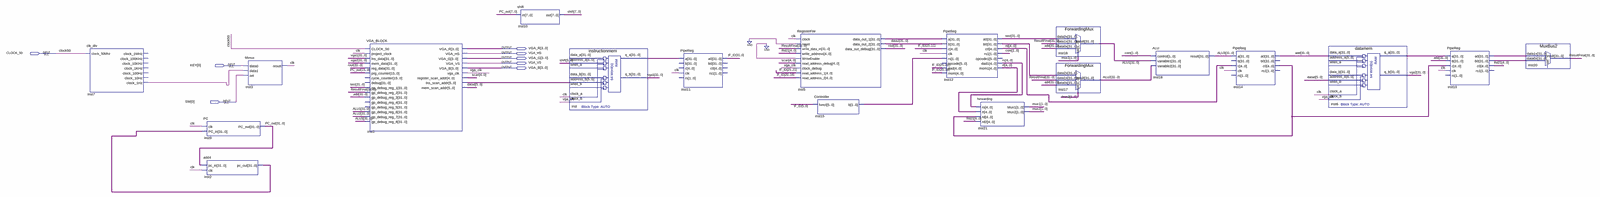
[diagram p0: schematic sheet, whole]
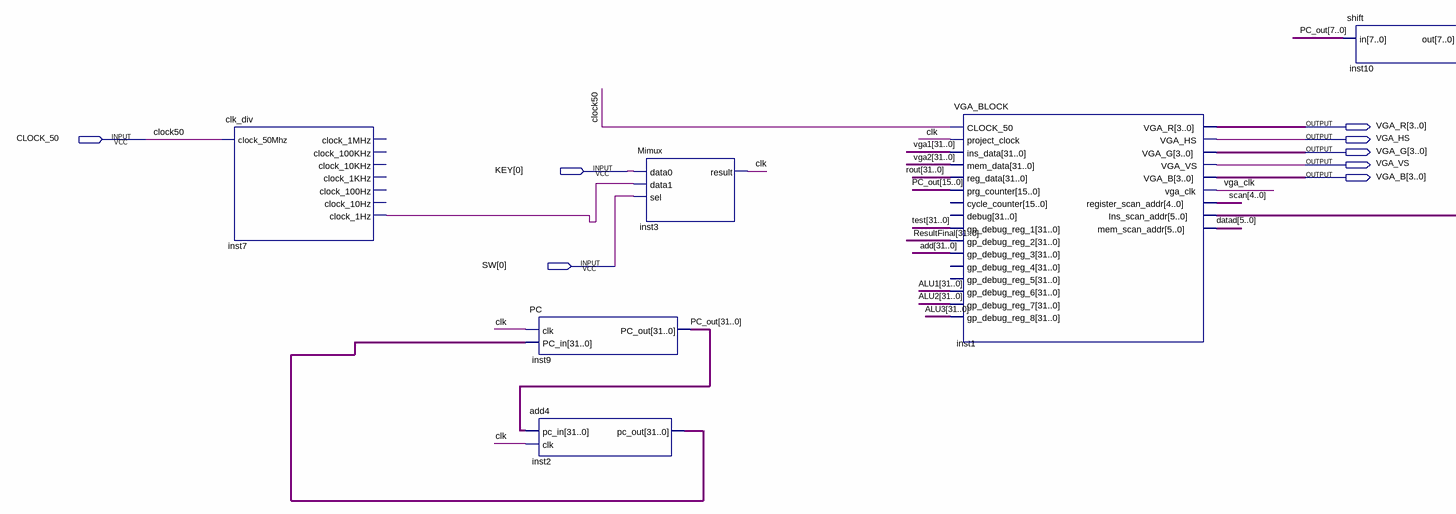
[diagram p1: schematic sheet, left part]
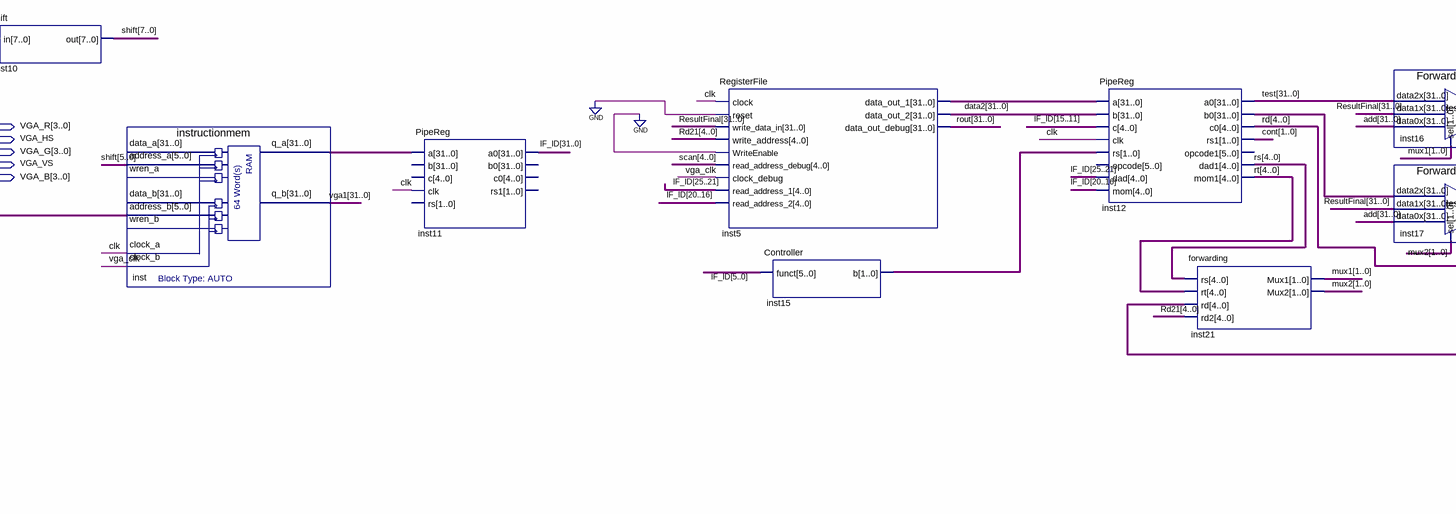
[diagram p2: schematic sheet, centre part]
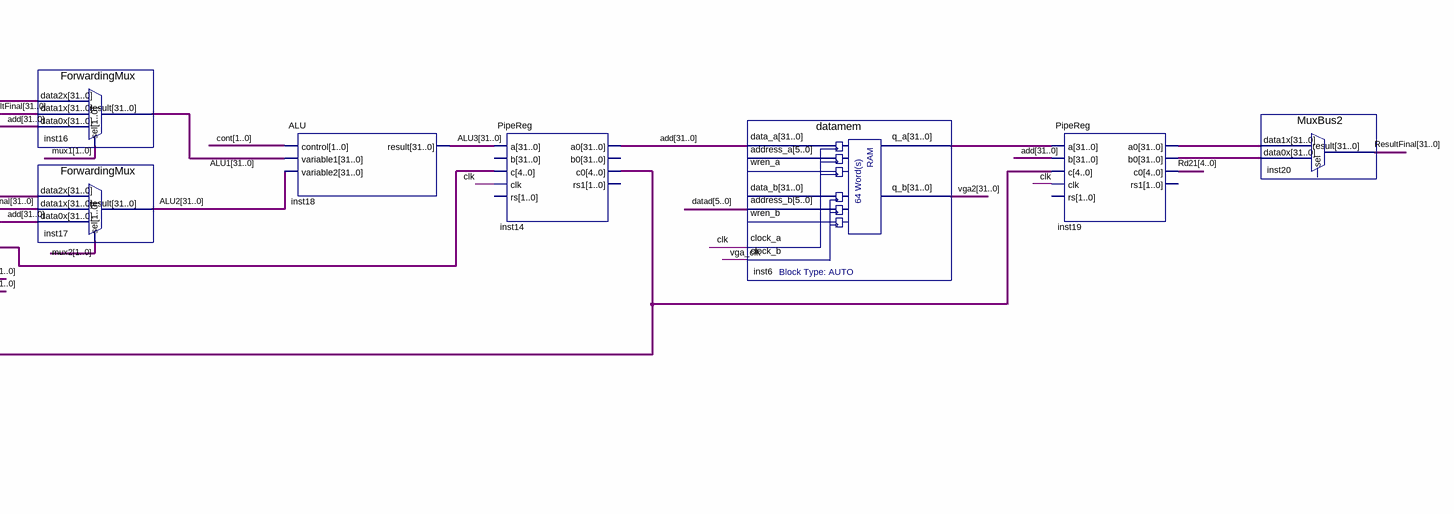
[diagram p3: schematic sheet, right part]
// Quartus schematic Lab5.bdf as structural Verilog: 19 symbols, 8 pins
module Lab5 (
  input  CLOCK_50,
  input  [0:0] KEY,
  input  [0:0] SW,
  output [3:0] VGA_R,
  output VGA_HS,
  output [3:0] VGA_G,
  output VGA_VS,
  output [3:0] VGA_B
);

  wire clk, inst7_clock_1hz, vga_clk;
  wire [1:0] cont, inst15_b, mux1, mux2;
  wire [4:0] inst14_c0, rd, Rd21, rs, rt, scan;
  wire [5:0] datad, inst1_ins_scan_addr;
  wire [7:0] shift;
  wire [31:0] add, ALU1, ALU2, ALU3, data2, IF_ID, inst2_pc_out, inst5_data_out_1, inst6_q_a, inst12_b0,
       inst19_a0, inst19_b0, inst_q_a, PC_out, ResultFinal, rout, test, vga1, vga2;

  clk_div inst7 (
    .clock_50Mhz(CLOCK_50), .clock_1Hz(inst7_clock_1hz));  // open: clock_1MHz, clock_100KHz, clock_10KHz, clock_1KHz, clock_100Hz, clock_10Hz
  PC inst9 (.clk(clk), .PC_in(inst2_pc_out), .PC_out(PC_out));
  add4 inst2 (.pc_in(PC_out), .clk(clk), .pc_out(inst2_pc_out));
  Mimux inst3 (.data0(KEY[0]), .data1(inst7_clock_1hz), .sel(SW[0]), .result(clk));
  VGA_BLOCK inst1 (
    .CLOCK_50(CLOCK_50), .project_clock(clk), .ins_data(vga1), .mem_data(vga2), .reg_data(rout),
    .prg_counter(PC_out[15:0]), .gp_debug_reg_1(test), .gp_debug_reg_2(ResultFinal), .gp_debug_reg_3(add),
    .gp_debug_reg_6(ALU1), .gp_debug_reg_7(ALU2), .gp_debug_reg_8(ALU3), .VGA_R(VGA_R), .VGA_HS(VGA_HS),
    .VGA_G(VGA_G), .VGA_VS(VGA_VS), .VGA_B(VGA_B), .vga_clk(vga_clk), .register_scan_addr(scan),
    .Ins_scan_addr(inst1_ins_scan_addr), .mem_scan_addr(datad));  // open: cycle_counter, debug, gp_debug_reg_4, gp_debug_reg_5
  shift inst10 (.in(PC_out[7:0]), .out(shift));
  instructionmem inst (
    .address_a(shift[5:0]), .address_b(inst1_ins_scan_addr), .clock_a(clk), .clock_b(vga_clk),
    .q_a(inst_q_a), .q_b(vga1));  // open: data_a, wren_a, data_b, wren_b
  PipeReg inst11 (.a(inst_q_a), .clk(clk), .a0(IF_ID));  // open: b, c, rs, b0, c0, rs1
  RegisterFile inst5 (
    .clock(clk), .reset(1'b0), .write_data_in(ResultFinal), .write_address(Rd21), .WriteEnable(1'b0),
    .read_address_debug(scan), .clock_debug(vga_clk), .read_address_1(IF_ID[25:21]),
    .read_address_2(IF_ID[20:16]), .data_out_1(inst5_data_out_1), .data_out_2(data2), .data_out_debug(rout));
  Controller inst15 (.funct(IF_ID[5:0]), .b(inst15_b));
  PipeReg inst12 (
    .a(inst5_data_out_1), .b(data2), .c(IF_ID[15:11]), .clk(clk), .rs(inst15_b), .dad(IF_ID[25:21]),
    .mom(IF_ID[20:16]), .a0(test), .b0(inst12_b0), .c0(rd), .rs1(cont), .dad1(rs), .mom1(rt));  // open: opcode, opcode1
  forwarding inst21 (.rs(rs), .rt(rt), .rd(inst14_c0), .rd2(Rd21), .Mux1(mux1), .Mux2(mux2));
  ForwardingMux inst16 (.data2x(test), .data1x(ResultFinal), .data0x(add), .sel(mux1), .result(ALU1));
  ForwardingMux inst17 (.data2x(inst12_b0), .data1x(ResultFinal), .data0x(add), .sel(mux2), .result(ALU2));
  ALU inst18 (.control(cont), .variable1(ALU1), .variable2(ALU2), .result(ALU3));
  PipeReg inst14 (.a(ALU3), .c(rd), .clk(clk), .a0(add), .c0(inst14_c0));  // open: b, rs, b0, rs1
  datamem inst6 (
    .data_a(add), .address_b(datad), .clock_a(clk), .clock_b(vga_clk), .q_a(inst6_q_a), .q_b(vga2));  // open: address_a, wren_a, data_b, wren_b
  PipeReg inst19 (
    .a(inst6_q_a), .b(add), .c(inst14_c0), .clk(clk), .a0(inst19_a0), .b0(inst19_b0), .c0(Rd21));  // open: rs, rs1
  MuxBus2 inst20 (.data1x(inst19_a0), .data0x(inst19_b0), .result(ResultFinal));  // open: sel

  // Other names for the same wires on the sheet: clock50 = CLOCK_50
endmodule
